# Altium project Inverter_2kW.PrjPcb
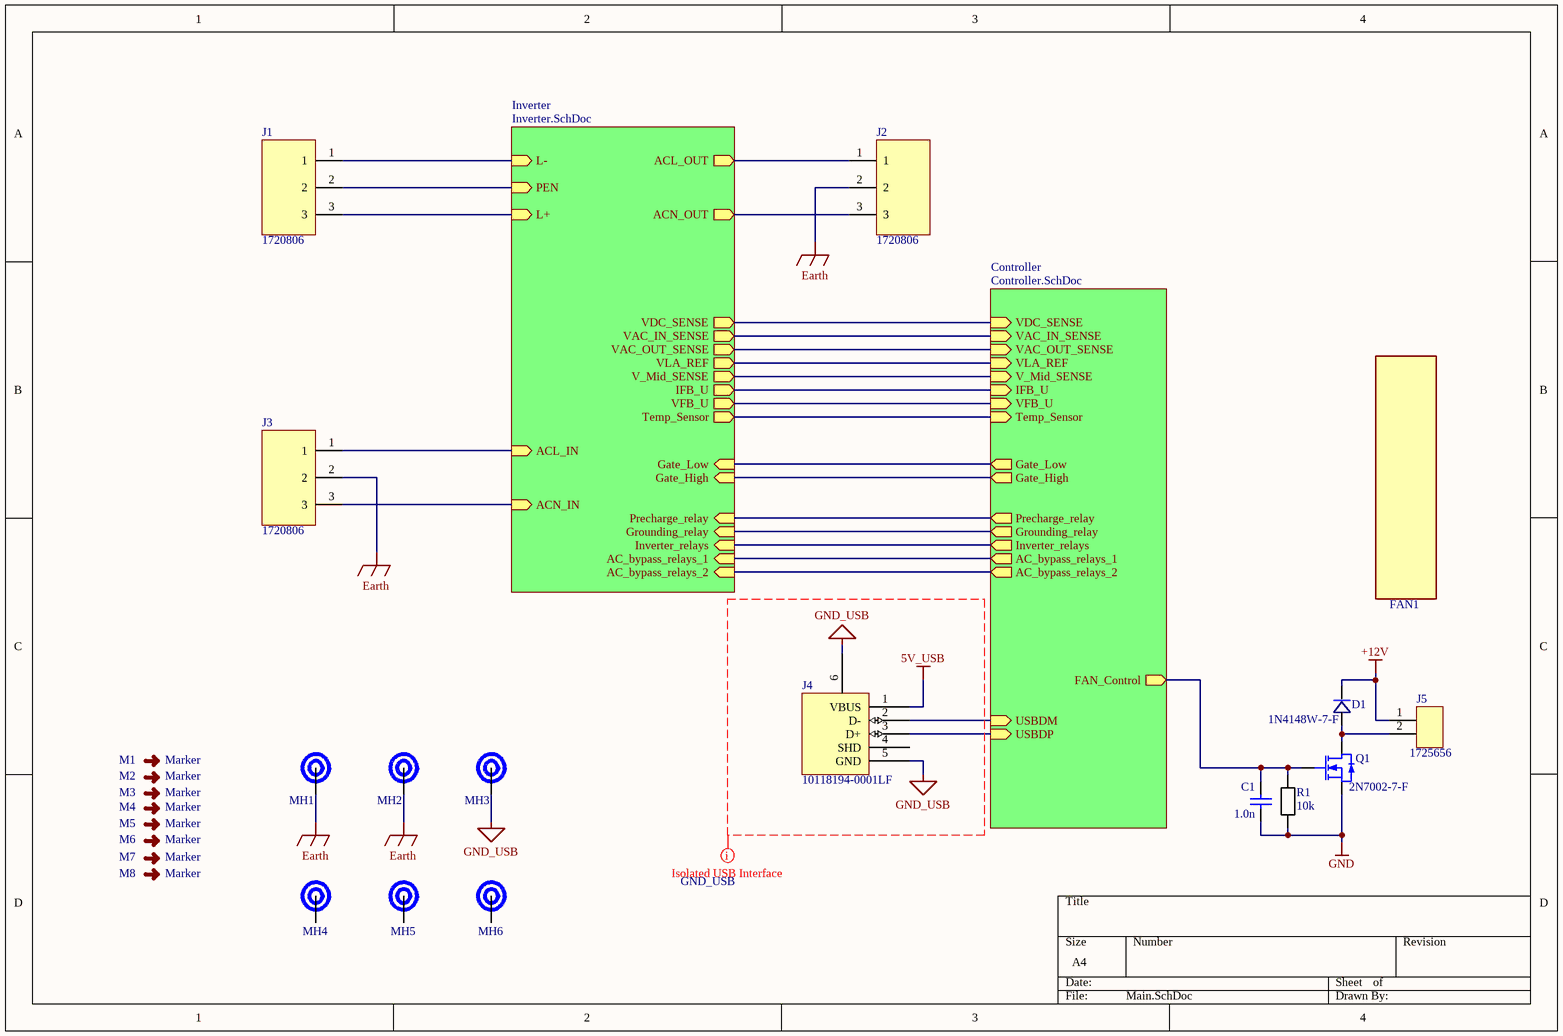
[diagram p0: Main.SchDoc]
2 sheets, 200 parts. Net scope: hierarchical (ports join the sheet entries above them; power ports are global).
Board file: Inverter_2kW.PcbDoc
Sheets:
  Main.SchDoc
    Inverter = Inverter.SchDoc

## Sheet Main.SchDoc
size A4

### Parts
C1  1.0n  [C0603]
D1  1N4148W-7-F  [SOD123]
FAN1  FAN_60*60mm  [FAN_60*60mm]  (value not drawn)
J1  1720806  [1720806]
J2  1720806  [1720806]
J3  1720806  [1720806]
J4  10118194-0001LF  [10118194-0001LF]
J5  1725656  [1725656]
M1  Marker  [PASSER-KREIS]  (no BOM)
M2  Marker  [PASSER-KREIS]  (no BOM)
M3  Marker  [PASSER-KREIS]  (no BOM)
M4  Marker  [PASSER-KREIS]  (no BOM)
M5  Marker  [PASSER-KREIS]  (no BOM)
M6  Marker  [PASSER-KREIS]  (no BOM)
M7  Marker  [PASSER-KREIS]  (no BOM)
M8  Marker  [PASSER-KREIS]  (no BOM)
MH1  No Fit  [MountingHole]  (value not drawn)
MH2  No Fit  [MountingHole]  (value not drawn)
MH3  No Fit  [MountingHole]  (value not drawn)
MH4  No Fit  [MountingHole_Cutout]  (value not drawn)
MH5  No Fit  [MountingHole_Cutout]  (value not drawn)
MH6  No Fit  [MountingHole_Cutout]  (value not drawn)
Q1  2N7002-7-F  [SOT23-3N]
R1  10k  [R0603]

### Sub-sheets
Controller = Controller.SchDoc (file not in this document): VDC_SENSE (in), VAC_IN_SENSE (in), VAC_OUT_SENSE (in), VLA_REF (in), IFB_U (in), VFB_U (in), Temp_Sensor (in), V_Mid_SENSE (in), Gate_Low (out), Gate_High (out), Precharge_relay (out), Grounding_relay (out), Inverter_relays (out), AC_bypass_relays_1 (out), USBDM (in), USBDP (in), AC_bypass_relays_2 (out), FAN_Control (out)
Inverter = Inverter.SchDoc: L- (in), L+ (in), ACL_OUT (out), ACN_OUT (out), PEN (in), ACL_IN (in), ACN_IN (in), VDC_SENSE (out), VAC_IN_SENSE (out), VAC_OUT_SENSE (out), VLA_REF (out), IFB_U (out), VFB_U (out), Temp_Sensor (out), V_Mid_SENSE (out), Gate_Low (in), Gate_High (in), Precharge_relay (in), Grounding_relay (in), Inverter_relays (in), AC_bypass_relays_1 (in), AC_bypass_relays_2 (in)

### Nets
5V_USB: J4.1(VBUS)
+12V: D1.C J5.1
Earth: J2.2 J3.2 MH1.0 MH2.0
GND: C1.1 Q1.2(S) R1.2
GND_USB: J4.5(GND) J4.6 MH3.0
ACL_IN: J3.1 ; sheet Inverter/ACL_IN
ACL_OUT: J2.1 ; sheet Inverter/ACL_OUT
ACN_IN: J3.3 ; sheet Inverter/ACN_IN
ACN_OUT: J2.3 ; sheet Inverter/ACN_OUT
PEN: J1.2 ; sheet Inverter/PEN
VLA_REF_1: sheet Controller/VLA_REF, sheet Inverter/VLA_REF
NetC1_2: C1.2 Q1.1(G) R1.1 ; sheet Controller/FAN_Control
NetC3_2: sheet Controller/Precharge_relay, sheet Inverter/Precharge_relay
NetC7_2: sheet Controller/VFB_U, sheet Inverter/VFB_U
NetC21_2: J1.1 ; sheet Inverter/L-
NetC22_2: J1.3 ; sheet Inverter/L+
NetC23_2: sheet Controller/Grounding_relay, sheet Inverter/Grounding_relay
NetC25_2: sheet Controller/AC_bypass_relays_1, sheet Inverter/AC_bypass_relays_1
NetC49_2: sheet Controller/VDC_SENSE, sheet Inverter/VDC_SENSE
NetC52_2: sheet Controller/V_Mid_SENSE, sheet Inverter/V_Mid_SENSE
NetD1_A: D1.A J5.2 Q1.3(D)
NetJ4_2: J4.2(D-) ; sheet Controller/USBDM
NetJ4_3: J4.3(D+) ; sheet Controller/USBDP
NetR20_2: sheet Controller/Temp_Sensor, sheet Inverter/Temp_Sensor
NetR21_1: sheet Controller/Inverter_relays, sheet Inverter/Inverter_relays
NetR26_1: sheet Controller/Gate_High, sheet Inverter/Gate_High
NetR32_1: sheet Controller/AC_bypass_relays_2, sheet Inverter/AC_bypass_relays_2
NetR36_1: sheet Controller/Gate_Low, sheet Inverter/Gate_Low
NetR53_2: sheet Controller/VAC_IN_SENSE, sheet Inverter/VAC_IN_SENSE
NetR54_2: sheet Controller/VAC_OUT_SENSE, sheet Inverter/VAC_OUT_SENSE
NetU1_7: sheet Controller/IFB_U, sheet Inverter/IFB_U

Not connected (* = marked no-connect by the designer): J4 4(SHD); MH4 0; MH5 0; MH6 0

### Layout directives
net class GND_USB: 5V_USB, GND_USB

### Library data of the parts
C1 = CAP_YAG_CC0603KRNPO9BN102_NPO: Capacitor 1.0n 0603 +-10% 50V; MFR: Yageo; Type: NPO; Voltage (V): 50; Part Number: CAP_YAG_CC0603KRNPO9BN102_NPO; MPN: CC0603KRNPO9BN102; Category: Capacitor; Package / Case: 0603; Capacitor (Farad): 1.0n; Tolerance: +-10%; Thickness (mm): 0.8; Value: 1.0n
D1 = 1N4148W: Diodes - General Purpose, Power, Switching SURFACE MOUNT FAST SWITCHING DIODE; MFR: Diodes Incorporated; MPN: 1N4148W-7-F; Value: 1N4148W-7-F
J1-J3 = 1720806: Pluggable Terminal Blocks 3 Pos 7.62mm pitch Through Hole Header; MFR: Phoenix Contact; MPN: 1720806; Value: 1720806
J4 = 10118194-0001LF: CONN RCPT USB2.0 MICRO B SMD R/A; MFR: Amphenol FCI; Gender: Receptacle; Current Rating: 1.8A; Connector Type: USB,Receptacle; Number of Contacts: 5; Insulation Resistance: 1GR; Number of Ports: 1; Max Voltage Rating (AC): 100V; Pitch: 0.65mm; Supplier 1: Digi-Key; Supplier Part Number 1: 609-4618-1-ND; MPN: 10118194-0001LF; Stock 1: 145984; Pricing 1: 1=0.42, 10=0.393, 25=0.3536, 50=0.3144, 100=0.3013, 250=0.27512, 500=0.26202 (USD); Mount: Surface Mount,Horizontal; Contact Material: Copper Alloy; Contact Plating: Gold; Number of Terminals: 5; Housing Material: Polymer; Color: Black; Min Operating Temperature: -55°C; Max Operating Temperature: 85°C; Package Quantity: 9600; Packaging: Tape and Reel; Termination: Solder; Orientation: Right Angle; Features: Shielded; Length: 8.05mm; Depth: 5mm; Radiation Hardening: No; Lead Free: Lead Free; Flammability Rating: UL94 V-0; ComponentLink1URL: http://www.amphenol-icc.com/media/wysiwyg/files/drawing/10118194.pdf?src-supplier=Digi-Key; ComponentLink1Description: http://www.amphenol-icc.com/media/wysiwyg/files/drawing/10118194.pdf?src-supplier=Digi-Key; ComponentLink2URL: https://cdn.amphenol-icc.com/media/wysiwyg/files/drawing/10118194.pdf?src-supplier=Mouser; ComponentLink2Description: https://cdn.amphenol-icc.com/media/wysiwyg/files/drawing/10118194.pdf?src-supplier=Mouser; ComponentLink3URL: https://cdn.amphenol-icc.com/media/wysiwyg/files/drawing/10118194.pdf?src-supplier=Avnet; ComponentLink3Description: https://cdn.amphenol-icc.com/media/wysiwyg/files/drawing/10118194.pdf?src-supplier=Avnet; ComponentLink4URL: https://cdn.amphenol-icc.com/media/wysiwyg/files/drawing/10118194.pdf?src-supplier=Verical; ComponentLink4Description: https://cdn.amphenol-icc.com/media/wysiwyg/files/drawing/10118194.pdf?src-supplier=Verical; Value: 10118194-0001LF
J5 = Connector_2Pin: Fixed Terminal Blocks 2P 2.54mm 90DEG; MFR: Phoenix Contact; Value: 1725656; MPN: 1725656
M1-M8 = M: Text Field2: -1; Value: NB
MH1-MH6 = Mounting Hole
Q1 = MOSFET-N: MOSFET N-CH 60V 200MA SOT23-3; MFR: Diodes Incorporated; MPN: 2N7002-7-F; Value: 2N7002-7-F
R1 = RES: 0.1W/ 10kohm±1%; MPN: RC0603FR-0710KL; MFR: Yageo; Value: 10k
FAN1 = FAN_60*60mm: Value: FAN_60*60mm

## Sheet Inverter.SchDoc
size A1
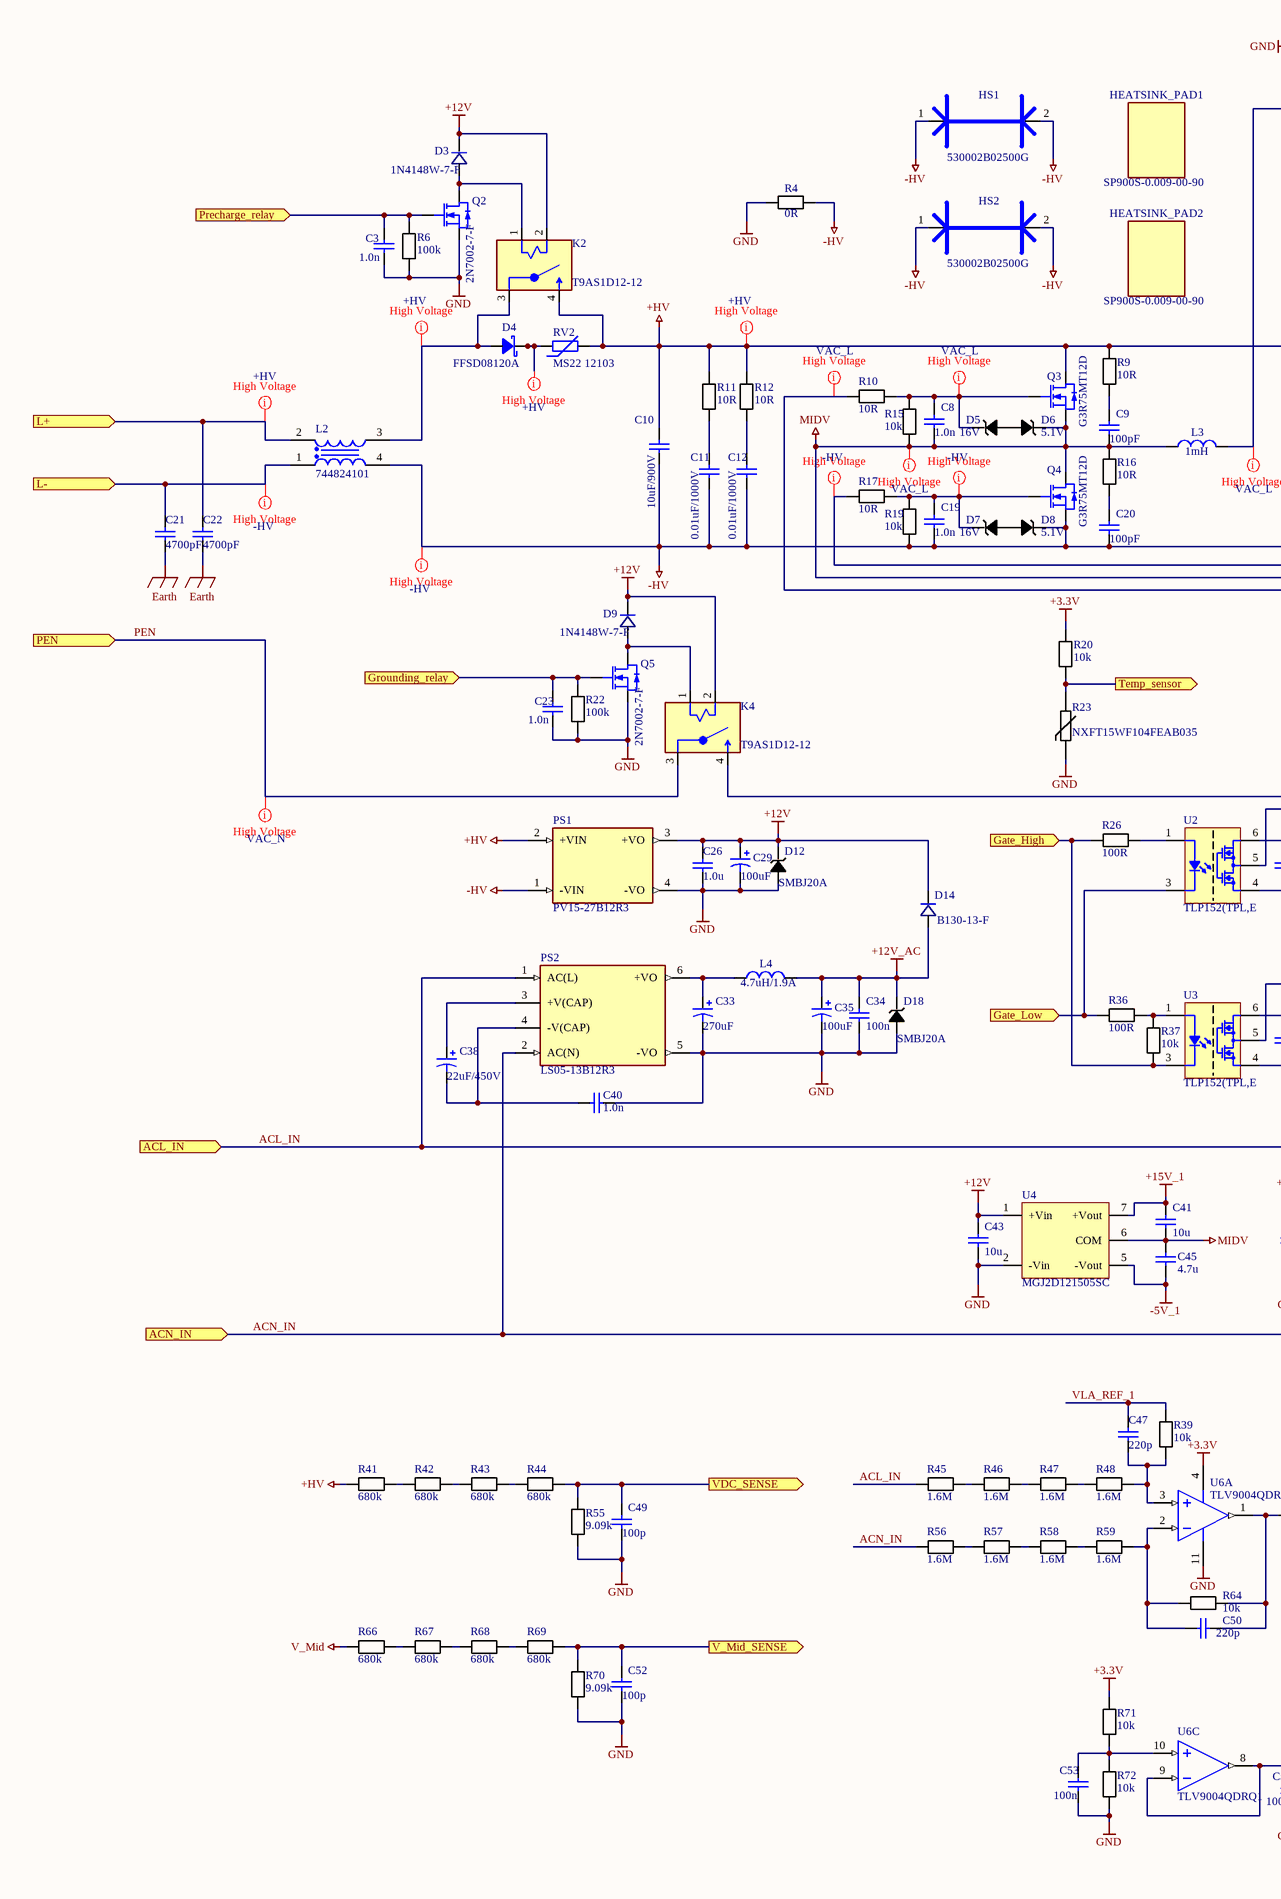
[diagram p1: Inverter.SchDoc, left]
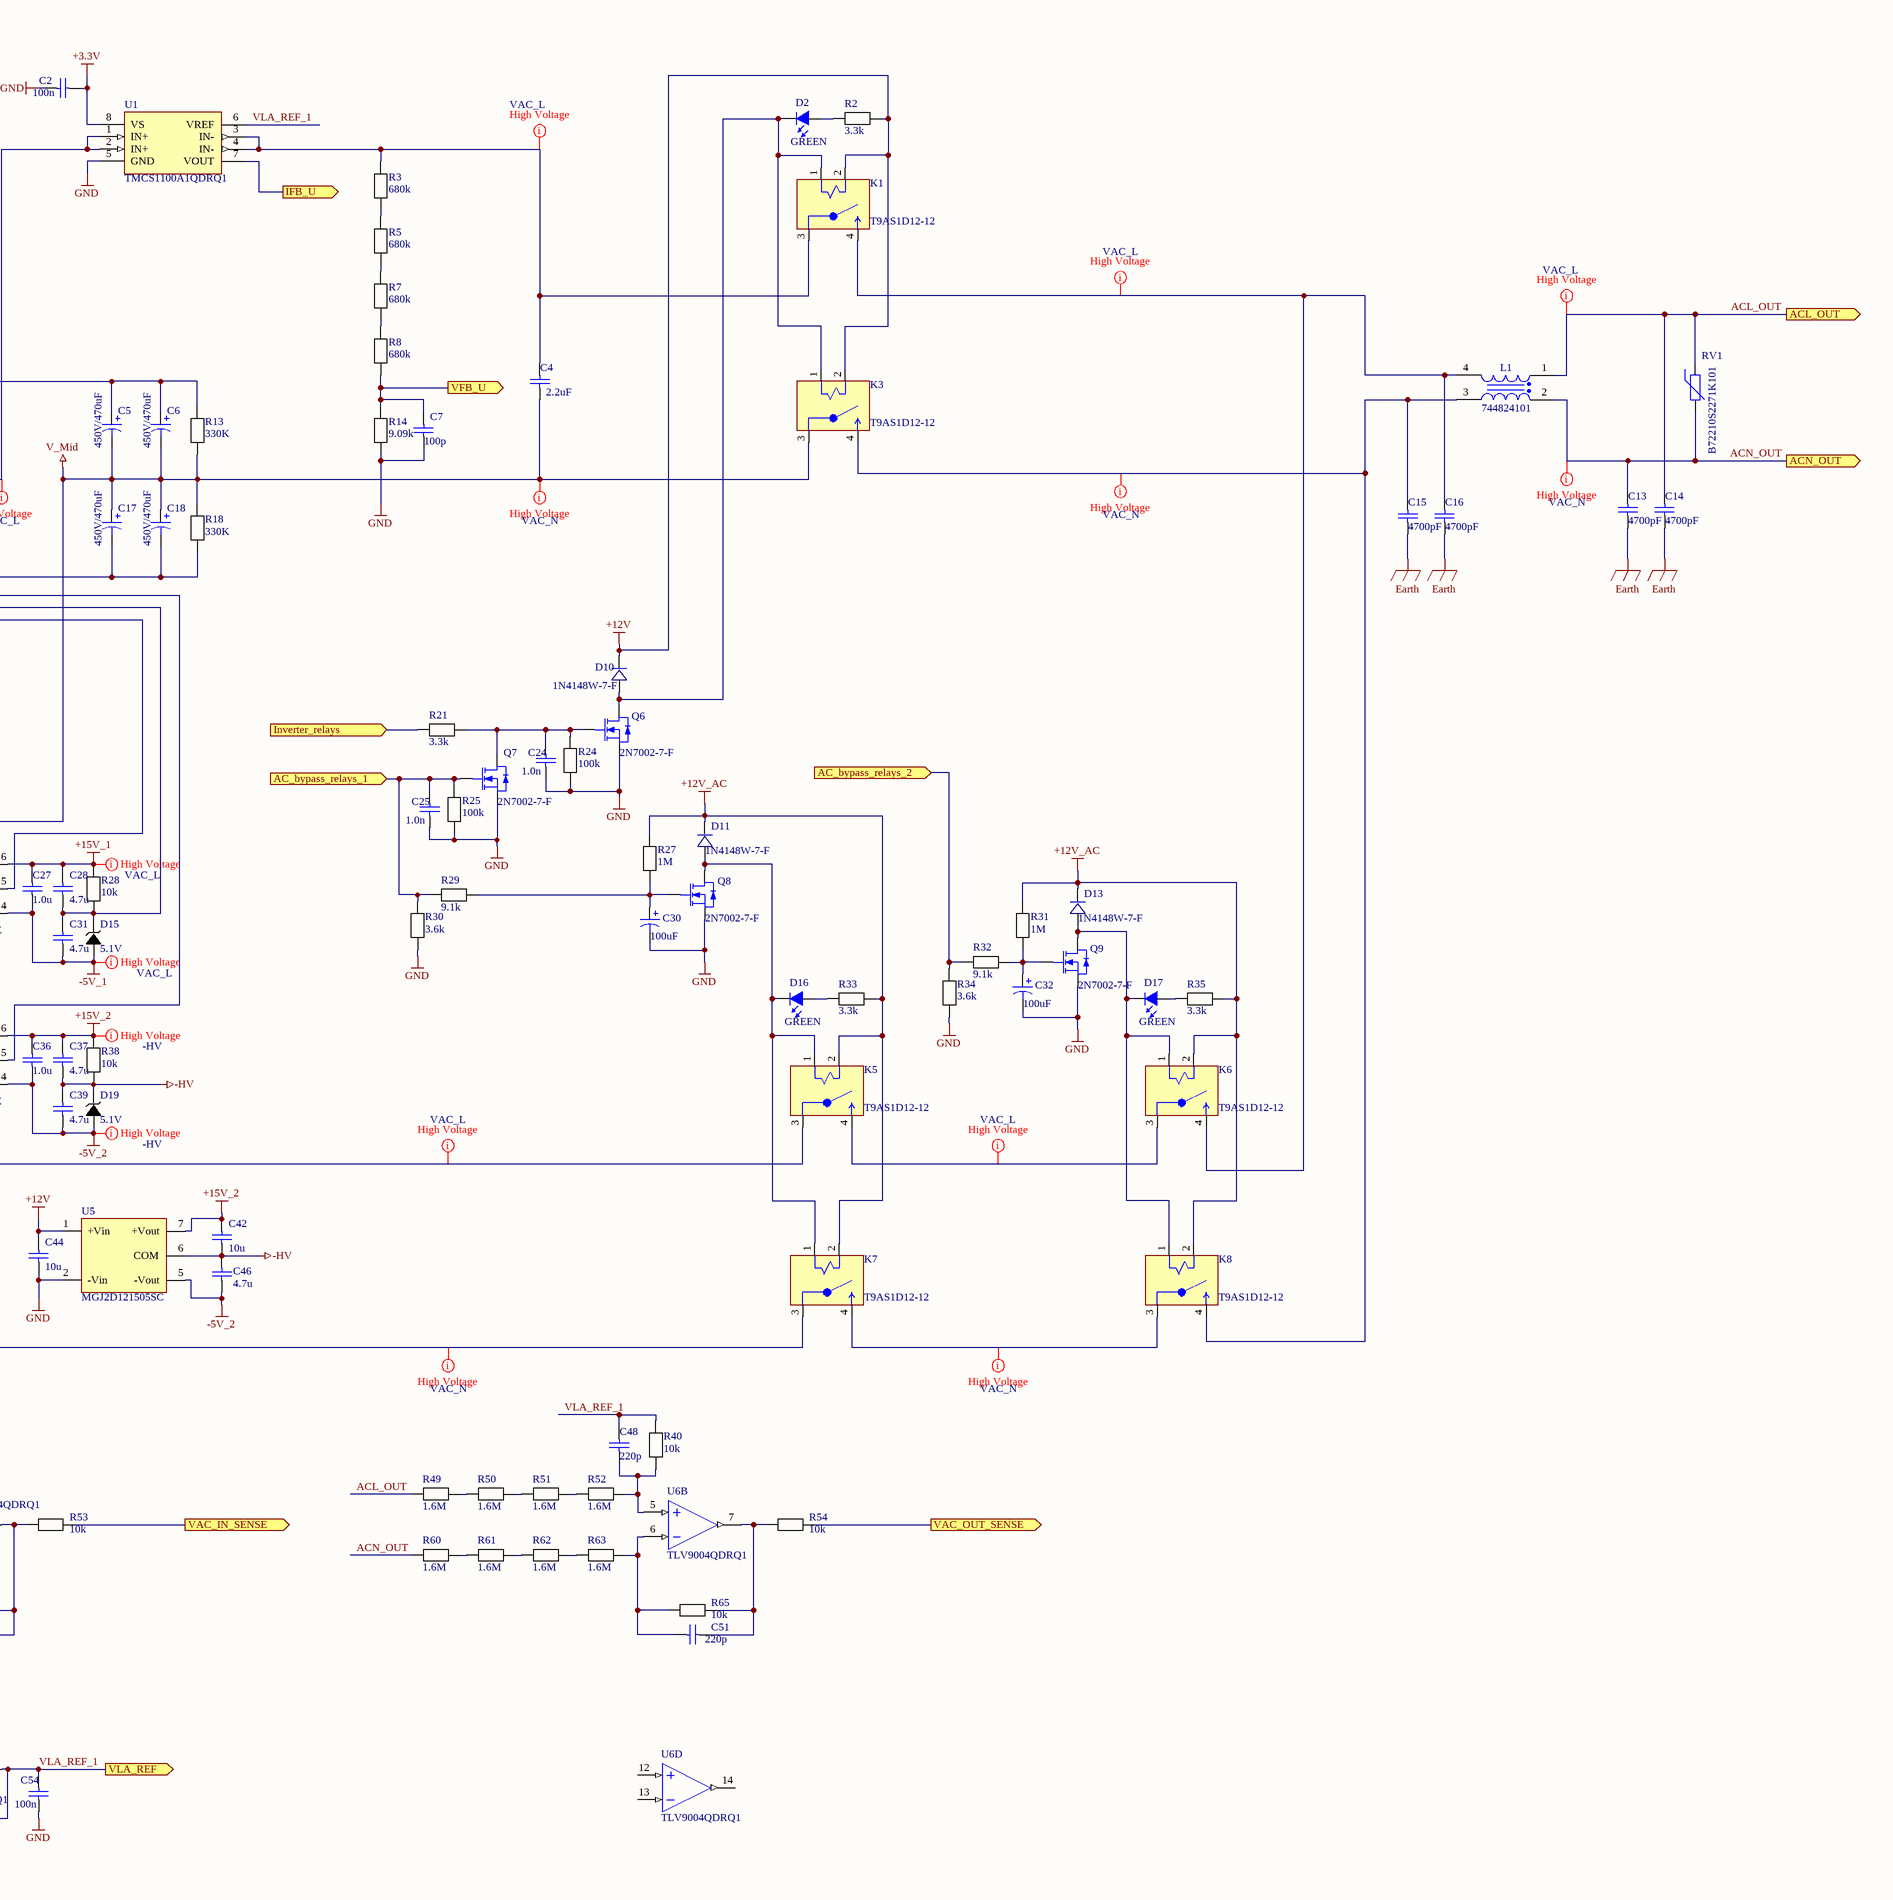
[diagram p2: Inverter.SchDoc, right]

### Parts
C2  100n  [C0603]
C3  1.0n  [C0603]
C4  2.2uF  [B32674]
C5  450V/470uF  [CAP_B43640B5477M000]
C6  450V/470uF  [CAP_B43640B5477M000]
C7  100p  [C0603]
C8  1.0n  [C0603]
C9  100pF  [C1210]
C10  10uF/900V  [MKP1848C61090KK2]
C11  0.01uF/1000V  [C1206]
C12  0.01uF/1000V  [C1206]
C13  4700pF  [CAP_C947U472MZVDBA7317]
C14  4700pF  [CAP_C947U472MZVDBA7317]
C15  4700pF  [CAP_C947U472MZVDBA7317]
C16  4700pF  [CAP_C947U472MZVDBA7317]
C17  450V/470uF  [CAP_B43640B5477M000]
C18  450V/470uF  [CAP_B43640B5477M000]
C19  1.0n  [C0603]
C20  100pF  [C1210]
C21  4700pF  [CAP_C947U472MZVDBA7317]
C22  4700pF  [CAP_C947U472MZVDBA7317]
C23  1.0n  [C0603]
C24  1.0n  [C0603]
C25  1.0n  [C0603]
C26  1.0u  [C0603]
C27  1.0u  [C0603]
C28  4.7u  [C1206]
C29  100uF  [CAP_EEUFC1E101S]
C30  100uF  [CAP_EEUFC1E101S]
C31  4.7u  [C1206]
C32  100uF  [CAP_EEUFC1E101S]
C33  270uF  [CAP_EEU-FK1E271B]
C34  100n  [C0603]
C35  100uF  [CAP_EEUFC1E101S]
C36  1.0u  [C0603]
C37  4.7u  [C1206]
C38  22uF/450V  [CAP_450BXW22MEFR12.5X20]
C39  4.7u  [C1206]
C40  1.0n  [C0603]
C41  10u  [C1206]
C42  10u  [C1206]
C43  10u  [C1206]
C44  10u  [C1206]
C45  4.7u  [C1206]
C46  4.7u  [C1206]
C47  220p  [C0603]
C48  220p  [C0603]
C49  100p  [C0603]
C50  220p  [C0603]
C51  220p  [C0603]
C52  100p  [C0603]
C53  100n  [C0603]
C54  100n  [C0603]
D2  GREEN  [LED0805]
D3  1N4148W-7-F  [SOD123]
D4  FFSD08120A  [DPAK-3]
D5  16V  [SOD323]
D6  5.1V  [SOD323]
D7  16V  [SOD323]
D8  5.1V  [SOD323]
D9  1N4148W-7-F  [SOD123]
D10  1N4148W-7-F  [SOD123]
D11  1N4148W-7-F  [SOD123]
D12  SMBJ20A  [DO-214AA2]
D13  1N4148W-7-F  [SOD123]
D14  B130-13-F  [DO-214AC]
D15  5.1V  [SOD323]
D16  GREEN  [LED0805]
D17  GREEN  [LED0805]
D18  SMBJ20A  [DO-214AA2]
D19  5.1V  [SOD323]
HEATSINK_PAD1  SP900S-0.009-00-90  [SP900S-0.009-00-90]
HEATSINK_PAD2  SP900S-0.009-00-90  [SP900S-0.009-00-90]
HS1  530002B02500G  [530002B02500G]
HS2  530002B02500G  [530002B02500G]
K1  T9AS1D12-12  [RELAY_T9AS1D12-12]
K2  T9AS1D12-12  [RELAY_T9AS1D12-12]
K3  T9AS1D12-12  [RELAY_T9AS1D12-12]
K4  T9AS1D12-12  [RELAY_T9AS1D12-12]
K5  T9AS1D12-12  [RELAY_T9AS1D12-12]
K6  T9AS1D12-12  [RELAY_T9AS1D12-12]
K7  T9AS1D12-12  [RELAY_T9AS1D12-12]
K8  T9AS1D12-12  [RELAY_T9AS1D12-12]
L1  1mH  [WE-CMB_Type L_L27.5W18.5H33]  (value not drawn)
L2  1mH  [WE-CMB_Type L_L27.5W18.5H33]  (value not drawn)
L3  1mH  [IND_FS-226060-2H305]
L4  4.7uH/1.9A  [IND_SRN3015C]
PS1  PV15-27B12R3  [CONV_PV15-27B12R3]
PS2  LS05-13B12R3  [CONV_LS05-13B12R3]
Q2  2N7002-7-F  [SOT23-3N]
Q3  G3R75MT12D  [TO247-3]
Q4  G3R75MT12D  [TO247-3]
Q5  2N7002-7-F  [SOT23-3N]
Q6  2N7002-7-F  [SOT23-3N]
Q7  2N7002-7-F  [SOT23-3N]
Q8  2N7002-7-F  [SOT23-3N]
Q9  2N7002-7-F  [SOT23-3N]
R2  3.3k  [R0603]
R3  680k  [R1206]
R4  0R  [R1206]
R5  680k  [R1206]
R6  100k  [R0603]
R7  680k  [R1206]
R8  680k  [R1206]
R9  10R  [R1210]
R10  10R  [R1210]
R11  10R  [R1210]
R12  10R  [R1210]
R13  330K  [THT_R(3W)]
R14  9.09k  [R0603]
R15  10k  [R0603]
R16  10R  [R1210]
R17  10R  [R1210]
R18  330K  [THT_R(3W)]
R19  10k  [R0603]
R20  10k  [R0603]
R21  3.3k  [R0603]
R22  100k  [R0603]
R23  NXFT15WF104FEAB035  [NTC_Sensor]
R24  100k  [R0603]
R25  100k  [R0603]
R26  100R  [R0603]
R27  1M  [R0603]
R28  10k  [R0603]
R29  9.1k  [R0603]
R30  3.6k  [R0603]
R31  1M  [R0603]
R32  9.1k  [R0603]
R33  3.3k  [R0603]
R34  3.6k  [R0603]
R35  3.3k  [R0603]
R36  100R  [R0603]
R37  10k  [R0603]
R38  10k  [R0603]
R39  10k  [R0603]
R40  10k  [R0603]
R41  680k  [R1206]
R42  680k  [R1206]
R43  680k  [R1206]
R44  680k  [R1206]
R45  1.6M  [R1206]
R46  1.6M  [R1206]
R47  1.6M  [R1206]
R48  1.6M  [R1206]
R49  1.6M  [R1206]
R50  1.6M  [R1206]
R51  1.6M  [R1206]
R52  1.6M  [R1206]
R53  10k  [R0603]
R54  10k  [R0603]
R55  9.09k  [R0603]
R56  1.6M  [R1206]
R57  1.6M  [R1206]
R58  1.6M  [R1206]
R59  1.6M  [R1206]
R60  1.6M  [R1206]
R61  1.6M  [R1206]
R62  1.6M  [R1206]
R63  1.6M  [R1206]
R64  10k  [R0603]
R65  10k  [R0603]
R66  680k  [R1206]
R67  680k  [R1206]
R68  680k  [R1206]
R69  680k  [R1206]
R70  9.09k  [R0603]
R71  10k  [R0603]
R72  10k  [R0603]
RV1  B72210S2271K101  [VAR_B72220S2321K101]
RV2  MS22 12103  [MS22 12103]
U1  TMCS1100A1QDRQ1  [SOIC-8]
U2  TLP152(TPL,E  [OPTO_TLP2366(V4-TPL,E]
U3  TLP152(TPL,E  [OPTO_TLP2366(V4-TPL,E]
U4  MGJ2D121505SC  [MGJ2D121505SC]
U5  MGJ2D121505SC  [MGJ2D121505SC]
U6  TLV9004QDRQ1  [SOIC127P600X175-14N]  (parts A,B,C,D of 4)

### Ports
AC_bypass_relays_1 (in), AC_bypass_relays_2 (in), ACL_IN (in), ACL_OUT (out), ACN_IN (in), ACN_OUT (out), Gate_High (in), Gate_Low (in), Grounding_relay (in), IFB_U (out), Inverter_relays (in), L+ (in), L- (in), PEN (in), Precharge_relay (in), Temp_sensor (out), V_Mid_SENSE (out), VAC_IN_SENSE (out), VAC_OUT_SENSE (out), VDC_SENSE (out), VFB_U (out), VLA_REF (out)

### Nets
+3.3V: C2.2 R20.1 R71.1 U1.8(VS) U6.4(VCC)
+12V: C26.2 C29.1 C43.2 C44.2 D3.C D9.C D10.C D12.C D14.C K1.2(A2) K2.2(A2) K3.2(A2) K4.2(A2) PS1.3(+VO) R2.2 U4.1(+Vin) U5.1(+Vin)
+12V_AC: C34.2 C35.1 D11.C D13.C D14.A D18.C K5.2(A2) K6.2(A2) K7.2(A2) K8.2(A2) L4.2 R27.2 R31.2 R33.2 R35.2
+15V_1: C27.2 C28.2 C41.2 R28.2 U2.6(Vcc) U4.7(+Vout)
+15V_2: C36.2 C37.2 C42.2 R38.2 U3.6(Vcc) U5.7(+Vout)
+HV: C5.1 C6.1 C10.2 K2.4(NO) PS1.2(+VIN) Q3.2(D) R9.2 R11.2 R12.2 R13.2 R41.2 RV2.2
-5V_1: C27.1 C31.1 C45.1 D15.A U2.4(GND) U4.5(-Vout)
-5V_2: C36.1 C39.1 C46.1 D19.A U3.4(GND) U5.5(-Vout)
-HV: C10.1 C11.1 C12.1 C17.2 C18.2 C19.1 C20.1 C37.1 C39.2 C42.1 C46.2 D8.C D19.C HS1.1 HS1.2 HS2.1 HS2.2 L2.4 PS1.1(-VIN) Q4.3(S) R4.2 R18.1 R19.1 R38.1 U5.6(COM)
Earth: C13.1 C14.1 C15.1 C16.1 C21.1 C22.1
GND: C2.1 C3.1 C7.1 C23.1 C24.1 C25.1 C26.1 C29.2 C30.2 C32.2 C33.2 C34.1 C35.2 C40.1 C43.1 C44.1 C49.1 C52.1 C53.1 C54.1 D12.A D18.A PS1.4(-VO) PS2.5(-VO) Q2.2(S) Q5.2(S) Q6.2(S) Q7.2(S) Q8.2(S) Q9.2(S) R4.1 R6.2 R14.1 R22.2 R23.2 R24.2 R25.2 R30.1 R34.1 R55.1 R70.1 R72.2 U1.5(GND) U4.2(-Vin) U5.2(-Vin) U6.11(GND)
MIDV: C8.1 C9.1 C28.1 C31.2 C41.1 C45.2 D6.C D15.C L3.1 Q3.3(S) Q4.2(D) R15.1 R16.2 R28.1 U4.6(COM)
V_Mid: C4.1 C5.2 C6.2 C17.1 C18.1 K3.3(C) K4.4(NO) R13.1 R18.2 R66.2
ACL_IN: K5.3(C) PS2.1(AC(L)) R45.1 ; port ACL_IN
ACL_OUT: C14.2 L1.1 R49.1 RV1.1 ; port ACL_OUT
ACN_IN: K7.3(C) PS2.2(AC(N)) R56.1 ; port ACN_IN
ACN_OUT: C13.2 L1.2 R60.1 RV1.2 ; port ACN_OUT
PEN: K4.3(C) ; port PEN
VLA_REF_1: C47.2 C48.2 C54.2 R39.2 R40.2 U1.6(VREF) U6.8(OUT3) U6.9(IN3-) ; port VLA_REF
NetC3_2: C3.2 Q2.1(G) R6.1 ; port Precharge_relay
NetC4_2: C4.2 K1.3(C) R3.2 U1.3(IN-) U1.4(IN-)
NetC7_2: C7.2 R8.1 R14.2 ; port VFB_U
NetC8_2: C8.2 D5.C Q3.1(G) R10.1 R15.2
NetC9_2: C9.2 R9.1
NetC11_2: C11.2 R11.1
NetC12_2: C12.2 R12.1
NetC15_2: C15.2 K3.4(NO) K8.4(NO) L1.3
NetC16_2: C16.2 K1.4(NO) K6.4(NO) L1.4
NetC19_2: C19.2 D7.C Q4.1(G) R17.1 R19.2
NetC20_2: C20.2 R16.1
NetC21_2: C21.2 L2.1 ; port L-
NetC22_2: C22.2 L2.2 ; port L+
NetC23_2: C23.2 Q5.1(G) R22.1 ; port Grounding_relay
NetC24_2: C24.2 Q6.1(G) Q7.3(D) R21.2 R24.1
NetC25_2: C25.2 Q7.1(G) R25.1 R29.1 R30.2 ; port AC_bypass_relays_1
NetC30_1: C30.1 Q8.1(G) R27.1 R29.2
NetC32_1: C32.1 Q9.1(G) R31.1 R32.2
NetC33_1: C33.1 L4.1 PS2.6(+VO)
NetC38_1: C38.1 PS2.3(+V(CAP))
NetC38_2: C38.2 C40.2 PS2.4(-V(CAP))
NetC47_1: C47.1 R39.1 R48.2 U6.3(IN1+)
NetC48_1: C48.1 R40.1 R52.2 U6.5(IN2+)
NetC49_2: C49.2 R44.1 R55.2 ; port VDC_SENSE
NetC50_1: C50.1 R53.1 R64.2 U6.1(OUT1)
NetC50_2: C50.2 R59.2 R64.1 U6.2(IN1-)
NetC51_1: C51.1 R54.1 R65.2 U6.7(OUT2)
NetC51_2: C51.2 R63.2 R65.1 U6.6(IN2-)
NetC52_2: C52.2 R69.1 R70.2 ; port V_Mid_SENSE
NetC53_2: C53.2 R71.2 R72.1 U6.10(IN3+)
NetD2_A: D2.A R2.1
NetD2_C: D2.C D10.A K1.1(A1) K3.1(A1) Q6.3(D)
NetD3_A: D3.A K2.1(A1) Q2.3(D)
NetD4_1: D4.1(C) D4.4(C) RV2.1
NetD4_3: D4.3(A) K2.3(C) L2.3
NetD5_A: D5.A D6.A
NetD7_A: D7.A D8.A
NetD9_A: D9.A K4.1(A1) Q5.3(D)
NetD11_A: D11.A D16.C K5.1(A1) K7.1(A1) Q8.3(D)
NetD13_A: D13.A D17.C K6.1(A1) K8.1(A1) Q9.3(D)
NetD16_A: D16.A R33.1
NetD17_A: D17.A R35.1
NetK5_4: K5.4(NO) K6.3(C)
NetK7_4: K7.4(NO) K8.3(C)
NetL3_2: L3.2 U1.1(IN+) U1.2(IN+)
NetR3_1: R3.1 R5.2
NetR5_1: R5.1 R7.2
NetR7_1: R7.1 R8.2
NetR10_2: R10.2 U2.5(Vo)
NetR17_2: R17.2 U3.5(Vo)
NetR20_2: R20.2 R23.1 ; port Temp_sensor
NetR21_1: R21.1 ; port Inverter_relays
NetR26_1: R26.1 R37.1 U3.3(C) ; port Gate_High
NetR26_2: R26.2 U2.1(A)
NetR32_1: R32.1 R34.2 ; port AC_bypass_relays_2
NetR36_1: R36.1 U2.3(C) ; port Gate_Low
NetR36_2: R36.2 R37.2 U3.1(A)
NetR41_1: R41.1 R42.2
NetR42_1: R42.1 R43.2
NetR43_1: R43.1 R44.2
NetR45_2: R45.2 R46.1
NetR46_2: R46.2 R47.1
NetR47_2: R47.2 R48.1
NetR49_2: R49.2 R50.1
NetR50_2: R50.2 R51.1
NetR51_2: R51.2 R52.1
NetR53_2: R53.2 ; port VAC_IN_SENSE
NetR54_2: R54.2 ; port VAC_OUT_SENSE
NetR56_2: R56.2 R57.1
NetR57_2: R57.2 R58.1
NetR58_2: R58.2 R59.1
NetR60_2: R60.2 R61.1
NetR61_2: R61.2 R62.1
NetR62_2: R62.2 R63.1
NetR66_1: R66.1 R67.2
NetR67_1: R67.1 R68.2
NetR68_1: R68.1 R69.2
NetU1_7: U1.7(VOUT) ; port IFB_U

Not connected (* = marked no-connect by the designer): U6 12(IN4+) 13(IN4-) 14(OUT4)

### Layout directives
net class +HV: +HV, NetC22_2, NetD4_1, NetD4_3
net class -HV: +15V_2, -5V_2, -HV, NetC19_2, NetC21_2, NetR17_2
net class VAC_L: +15V_1, -5V_1, ACL_IN, ACL_OUT, MIDV, NetC4_2, NetC8_2, NetC16_2, NetK5_4, NetL3_2, NetR10_2
net class VAC_N: ACN_IN, ACN_OUT, NetC15_2, NetK7_4, PEN, V_Mid

### Library data of the parts
C2 C34 C53 C54 = CAP_YAG_CC0603KRX7R9BB104_X7R: Capacitor 100n 0603 +-10% 50V; MFR: Yageo; Type: X7R; Voltage (V): 50; Part Number: CAP_YAG_CC0603KRX7R9BB104_X7R; MPN: CC0603KRX7R9BB104; Package / Case: 0603; Capacitor (Farad): 100n; Tolerance: +-10%; Thickness (mm): 0.8; Value: 100n
C3 C8 C19 C23-C25 C40 = CAP_YAG_CC0603KRNPO9BN102_NPO: as C1 on sheet Main; Part Number: CAP_YAG_CC0603KRNPO9BN102_NPO; MPN: CC0603KRNPO9BN102; Category: Capacitor; Package / Case: 0603; Capacitor (Farad): 1.0n; Tolerance: +-10%; Thickness (mm): 0.8; Value: 1.0n
C4 = CAP: MPN: B32674D6225K; MFR: EPCOS / TDK; Value: 2.2uF; Supplier: EPCOS / TDK
C5 C6 C17 C18 = Cap Pol1: Aluminium Electrolytic Capacitors - Snap In 450VDC 470uF 20% PVC STD 6.3mm Term; MPN: B43640B5477M000; MFR: EPCOS / TDK; Value: 450V/470uF
C7 C49 C52 = CAP_YAG_CC0603KRNPO9BN101_NPO: Capacitor 100p 0603 +-10% 50V; MFR: Yageo; Type: NPO; Voltage (V): 50; Part Number: CAP_YAG_CC0603KRNPO9BN101_NPO; MPN: CC0603KRNPO9BN101; Category: Capacitor; Package / Case: 0603; Capacitor (Farad): 100p; Tolerance: +-10%; Thickness (mm): 0.8; Value: 100p
C9 C20 = CAP: Capacitor 100p 1210 +-5% 1kV; MPN: VJ1210A101JXGAT5Z; MFR: Vishay; Value: 100pF
C10 = CAP: CAP FILM 10UF 10% 900VDC; MFR: Vishay / Roederstein; Value: 10uF/900V; MPN: MKP1848C61090KK2; Price: 2.88
C11 C12 = CAP: 0.01uF ±10% 1000V; MPN: GRM31CR73A103KW03L; MFR: Murata; Value: 0.01uF/1000V
C13-C16 C21 C22 = CAP: 4700pF ±20% 440VAC Ceramic Capacitor; MPN: C947U472MZVDBA7317; MFR: KEMET; Value: 4700pF
C26 = CAP_YAG_CC0603KRX7R9BB105_X7R: Capacitor 1.0u 0603 +-10% 50V; MFR: Yageo; Type: X7R; Voltage (V): 50; Part Number: CAP_YAG_CC0603KRX7R9BB105_X7R; MPN: CC0603KRX7R9BB105; Category: Capacitor; Package / Case: 0603; Capacitor (Farad): 1.0u; Tolerance: +-10%; Thickness (mm): 0.8; Value: 1.0u
C27 C36 = CAP_YAG_CC0603KRX5R8BB105_X5R: Capacitor 1.0u 0603 +-10% 25V; MFR: Yageo; MPN: CC0603KRX7R9BB105; Type: X5R; Voltage (V): 25; Part Number: CAP_YAG_CC0603KRX5R8BB105_X5R; Category: Capacitor; Package / Case: 0603; Capacitor (Farad): 1.0u; Tolerance: +-10%; Thickness (mm): 0.8; Value: 1.0u
C28 C31 C37 C39 C45 C46 = CAP_YAG_CC1206KKX7R8BB475: Capacitor 4.7u 1206 +-10% 25V; MFR: Yageo; Type: X7R; Voltage (V): 50; MPN: CC1206KKX7R8BB475; Category: Capacitor; Tolerance: +-10%; Value: 4.7u
C29 C30 C32 C35 = Cap Pol1: CAP ALUM 100UF 20% 25V SMD; MPN: EEU-FC1E101S; MFR: Panasonic; Value: 100uF
C33 = Cap Pol1: CAP ALUM 270UF 20% 25V SMD; MPN: EEU-FC1E271B; MFR: Panasonic; Value: 270uF
C38 = Cap Pol1: CAP ALUM 22UF 20% 450V SMD; MPN: 450BXW22MEFR12.5X20; MFR: Rubycon; Value: 22uF/450V
C41-C44 = CAP_YAG_CC1206KKX7R8BB106: Capacitor 10u 1206 +-10% 25V; MFR: Yageo; Type: X7R; Voltage (V): 50; MPN: CC1206KKX7R8BB106; Category: Capacitor; Tolerance: +-10%; Value: 10u
C47 C48 C50 C51 = CAP_YAG_CC0603KRNPO9BN221_NPO: Capacitor 220p 0603 +-10% 50V; MFR: Yageo; Type: NPO; Voltage (V): 50; Part Number: CAP_YAG_CC0603KRNPO9BN221_NPO; MPN: CC0603KRNPO9BN221; Category: Capacitor; Package / Case: 0603; Capacitor (Farad): 220p; Tolerance: +-10%; Thickness (mm): 0.8; Value: 220p
D2 D16 D17 = LED_SMD: SMD Surface Mount LED, 5 mA; MPN: VCDG1112H-4BY3C-TR; MFR: Stanley Electric; Value: GREEN
D3 D9-D11 D13 = 1N4148W: as D1 on sheet Main; MPN: 1N4148W-7-F; Value: 1N4148W-7-F
D4 = FFSD08120A: Schottky Diodes & Rectifiers 1200V 8A SIC SBD; MFR: onsemi; Value: FFSD08120A; MPN: FFSD08120A
D5 D7 = ZenerDiode: Zener Diodes 16V 300mW 5%; MPN: BZX384-C16,115; MFR: Nexperia; Value: 16V
D6 D8 D15 D19 = ZenerDiode: Zener Diodes 5.1V 300mW 5%; MPN: BZX384-C5V1,115; MFR: Nexperia; Value: 5.1V
D12 D18 = ZM4746A-GS08: ESD Suppressors / TVS Diodes 600W, 23.4V, 5%, Unidirectional, TVS; MFR: Taiwan Semiconductor; Value: SMBJ20A; MPN: SMBJ20A
D14 = B130-13-F: Schottky Diodes & Rectifiers 30V 1A; MFR: Diodes Incorporated; MPN: B130-13-F; Value: B130-13-F
HEATSINK_PAD1 HEATSINK_PAD2 = SP900S-0.009-00-90: Thermal Interface Products Sil-Pad, Low-Pressure, 0.009" Thickness, 21.84x18.80mm, TSP1600S/900S; MFR: Bergquist Company; MPN: SP900S-0.009-00-90; Value: SP900S-0.009-00-90
HS1 HS2 = 530002B02500G: MFR: Aavid; MPN: 530002B02500G; Value: 530002B02500G
K1-K8 = T9AS1D12-12: p&b Low Cost Pc Board Relay, Immersion Cleanable, 1 Form a _Spst-No_; MFR: TE Connectivity; Package: None; MPN: T9AS1D12-12; Value: T9AS1D12-12; Availability: Unavailable; Price: None; Comment_1: *
L1 L2 = 744824101: WE-CMB Common Mode Power Line Choke, THT, Type L, 1mH, 10A, 7mOhm; MFR: Wurth Elektronik; Case/Size Code: Type L; Insulation Test Voltage: 1500VAC; Material: MnZn; Rated Voltage (AC): 250V; MPN: 744824101; Category: Common Mode Chokes; Match Code: WE-CMB; ComponentLink1Description: Website Link; ComponentLink1URL: https://www.we-online.com/redexpert/article/744824101?ad; ComponentLink2Description: Datasheet Link; ComponentLink2URL: https://www.we-online.com/redexpert/spec/744824101?ad; Mount: Through Hole; Operating Temperature Max: 125°C; Operating Temperature Min: -40°C; Packaging: Carton; Length: 27.5mm; Width: 18.5mm; Height: 33mm; DC Resistance Max: 7mOhm; Inductance: 1mH; Rated Current: 10A
L3 = Inductor: Custom Inductor with FS-226060-2H305; MPN: Custom; Value: 1mH
L4 = Inductor: Power Inductors - SMD Ind,3x3x1.3mm,4.7uH20%,1.9A,shd; MPN: SRN3015C-4R7M; MFR: Bourns; Value: 4.7uH/1.9A
PS1 = PV15-27B12R3: Isolated Module DC DC Converter 1 Output 12V - - - 1A 100V - 1000V Input; MFR: Mornsun America, LLC; MPN: PV15-27B12R3; Check_prices: https://www.snapeda.com/parts/PV15-27B15R3/MORNSUN/view-part/?ref=eda; Package: CUSTOM-4 MORNSUN; SnapEDA_Link: https://www.snapeda.com/parts/PV15-27B15R3/MORNSUN/view-part/?ref=snap; Value: PV15-27B12R3; Price: None; Availability: Not in stock
PS2 = LS05-13B12R3: Enclosed AC DC Converters 1 Uitgang 12V 420mA 85 ~ 305 VAC, 70 ~ 430 VDC Input; MFR: Mornsun America, LLC; Availability: In Stock; Package: CUSTOM-6 MORNSUN; Price: None; Value: LS05-13B12R3; MPN: LS05-13B12R3
Q2 Q5-Q9 = MOSFET-N: as Q1 on sheet Main; MPN: 2N7002-7-F; Value: 2N7002-7-F
Q3 Q4 = MOSFET-N: MOSFET 1200V 75mO TO-247-3 G3R SiC MOSFET; MFR: GeneSiC Semiconductor; MPN: G3R75MT12D; Value: G3R75MT12D
R2 R21 R33 R35 = RES: 0.1W/ 3.3kohm±1%; MPN: RC0603FR-073K3L; MFR: Yageo; Value: 3.3k
R3 R5 R7 R8 R41-R44 R66-R69 = RES: 0.25W/ 680kohm±1%; MPN: RC1206FR-07680KL; MFR: Yageo; Value: 680k
R4 = RES: 0.25W/ 0ohm±0.05%; MPN: ERJ-8GEY0R00V; MFR: Panasonic; Value: 0R
R6 R22 R24 R25 = RES: 0.1W/ 100kohm±1%; MPN: RC0603FR-07100KL; MFR: Yageo; Value: 100k
R9-R12 R16 R17 = RES: 10 Ohms ±1% 0.5W; MPN: AC1210FR-0710RL; MFR: Yageo; Value: 10R
R13 R18 = RES: 330 kOhm, 3W; MPN: RR03J330KTB; MFR: TE Connectivity; Value: 330K
R14 R55 R70 = RES: 0.1W/ 9.09kohm±1%; MPN: RC0603FR-079K09L; MFR: Yageo; Value: 9.09k
R15 R19 R20 R28 R37-R39 R53 R54 R64 R65 R71 R72 = RES: as R1 on sheet Main; Value: 10k
R23 = NTC 100K 1% 0805 0.1W_1: NTC (Negative Temperature Coefficient) Thermistors; MFR: Murata; Value: NXFT15WF104FEAB035; MPN: NXFT15WF104FEAB035; Price: 0.59; Supplier: Mouser; Supplier Part Number: 81-NXFT15WF104FEAB35
R26 R36 = RES: 0.1W/ 100ohm±1%; MPN: RC0603FR-07100RL; MFR: Yageo; Value: 100R
R27 R31 = RES: 0.1W/ 1Mohm±1%; MPN: RC0603FR-071ML; MFR: Yageo; Value: 1M
R29 R32 = RES: 0.1W/ 9.1kohm±1%; MPN: RC0603FR-079K1L; MFR: Yageo; Value: 9.1k
R30 R34 = RES: 0.1W/ 3.6kohm±1%; MPN: RC0603FR-073K6L; MFR: Yageo; Value: 3.6k
R40 = RES: 0.1W/ 10kohm±1%; Manufacturer Part Number: RC0603FR-0710KL; Manufacturer: Yageo; Value: 10k
R45-R52 R56-R63 = RES: 0.25W/ 1.6Mohm±1%; MPN: RC1206FR-071M6L; MFR: Yageo; Value: 1.6M
RV1 = Res Varistor: Varistor (Voltage-Sensitive Resistor); MFR: EPCOS - TDK Electronics; Value: B72210S2271K101; MPN: B72210S2271K101
RV2 = Res Varistor: Varistor (Voltage-Sensitive Resistor); MFR: Ametherm; Value: MS22 12103; MPN: MS22 12103
U1 = TMCS1100A1QDRQ1: Board Mount Current Sensors Automotive, precisio n isolated current; MFR: Texas Instruments; MPN: TMCS1100A1QDRQ1; Value: TMCS1100A1QDRQ1
U2 U3 = TLP152(TPL,E: Isolated Gate Drivers Gate Drive Phcplr 3750 Vrms; MFR: Toshiba; MPN: TLP152(TPL,E; Value: TLP152(TPL,E
U4 U5 = MGJ2D121505SC: Isolated DC/DC Converters - Through Hole 2W 12-15VIN 5VOUT DC/DC; MFR: Murata; MPN: MGJ2D121505SC; Value: MGJ2D121505SC
U6 = TLV9004: Operational Amplifiers - Op Amps AEC-Q100, 4-channel, 1-MHz, low-noise, RRIO, operational amplifier for cost-optimized systems 14-SOIC -40 to 125; MFR: Texas Instruments; Value: TLV9004QDRQ1; MPN: TLV9004QDRQ1

## Nets that join several sheets
+12V: Main (D1.C J5.1), Inverter (17 pins)
Earth: Main (J2.2 J3.2 MH1.0 MH2.0), Inverter (6 pins)
GND: Main (C1.1 Q1.2 R1.2), Inverter (46 pins)
ACL_IN: Main (J3.1), Inverter (K5.3 PS2.1 R45.1)
ACL_OUT: Main (J2.1), Inverter (C14.2 L1.1 R49.1 RV1.1)
ACN_IN: Main (J3.3), Inverter (K7.3 PS2.2 R56.1)
ACN_OUT: Main (J2.3), Inverter (C13.2 L1.2 R60.1 RV1.2)
NetC21_2: Main (J1.1), Inverter (C21.2 L2.1)
NetC22_2: Main (J1.3), Inverter (C22.2 L2.2)
PEN: Main (J1.2), Inverter (K4.3)